# EAGLE design wheather_board_definitivo - ESP32 (EAGLE 9.6.2)
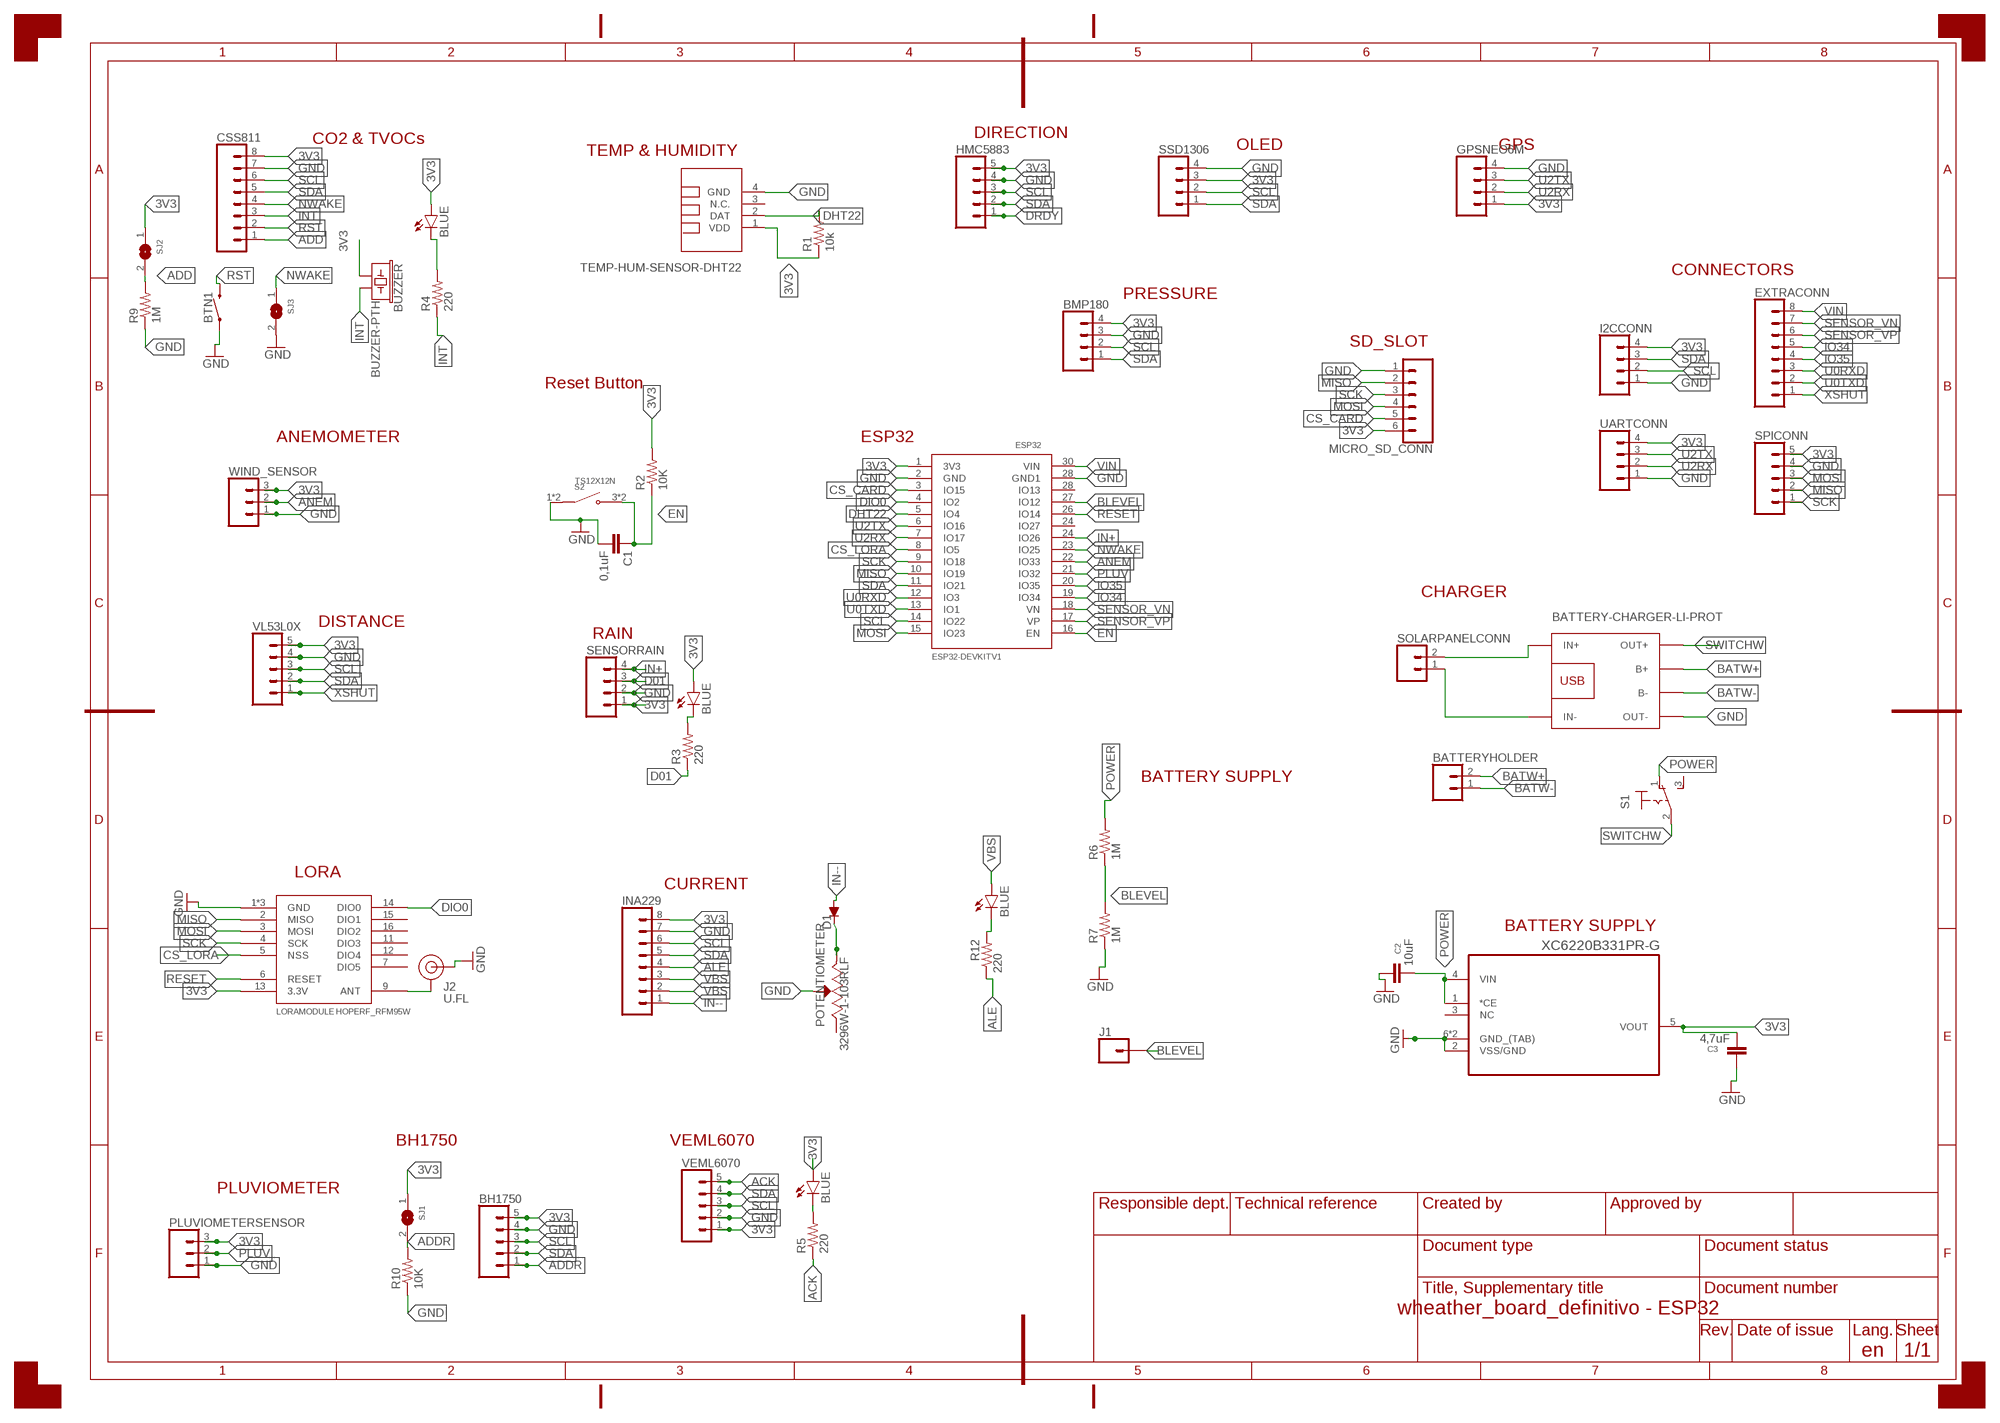
[diagram p0: schematic, sheet 1]
FRAME1 (A3_L_DOCFIELD_EN): LANGUAGE: en

## Parts
BATTERYCONN  BATTERY-CHARGER-LI-PROT  [BATTERY-CHARGER-LI-PROT]
BATTERYHOLDER  CONN_02LOCK  [1X02_LOCK]
BH1750  CONN_05  [1X05]
BMP180  CONN_04  [1X04]
BTN1  EN  MOMENTARY-SWITCH-SPST-SMD-6.0X3.5MM  [TACTILE_SWITCH_SMD_6.0X3.5MM]
BUZZER  BUZZER-PTH  [BUZZER-12MM]
C1  0,1uF  C-EUC0603  [C0603]
C2  10uF  C-EUC0603  [C0603]
C3  4,7uF  C-EUC0603  [C0603]
CSS811  CONN_08"  [1X08]
D1  DIODE_DIODE-SOD123  [DIODE_SOD123]
DHT22  TEMP-HUM-SENSOR-DHT22  [TEMP-HUM-SENSOR-DHT22]
ESP32  ESP32DEVKITV1  [ESP32-DEVKITV1]
EXTRACONN  CONN_08"  [1X08]
GPSNEO6M  CONN_04  [1X04]
HMC5883  CONN_05JST-VERT  [JST-5-PTH-VERT]
I2CCONN  CONN_04  [1X04]
INA229  CONN_08"  [1X08]
J1  CONN_01  [1X01]
J2  U.FL  U.FL2PIN  [U.FL]
LED1  BLUE  LED-BLUE0603  [LED-0603]
LED2  BLUE  LED-BLUE0603  [LED-0603]
LED3  BLUE  LED-BLUE0603  [LED-0603]
LED4  BLUE  LED-BLUE0603  [LED-0603]
LORAMODULE  HOPERF_RFM95W  [HOPERF_RFM95W]
MICRO_SD_CONN  CONN_06LOCK  [1X06_LOCK]
PLUVIOMETERSENSOR  CONN_03JST-PTH-VERT  [JST-3-PTH-VERT]
POTENTIOMETER  3296W-1-103RLF  [TRIM_3296W-1-103RLF]
R1  10k  R-US_R0603  [R0603]
R2  10K  R-US_R0603  [R0603]
R3  220  R-US_R0603  [R0603]
R4  220  R-US_R0603  [R0603]
R5  220  R-US_R0603  [R0603]
R6  1M  R-US_R0603  [R0603]
R7  1M  R-US_R0603  [R0603]
R9  1M  R-US_R0603  [R0603]
R10  10K  R-US_R0603  [R0603]
R12  220  R-US_R0603  [R0603]
S1  320-916  [320-916]
S2  TS12X12N  [SW_TS12X12N]
SENSORRAIN  CONN_04  [1X04]
SJ1  SOLDERJUMPER  [SOLDERJUMPER_ARROW_NOPASTE]
SJ2  SOLDERJUMPER  [SOLDERJUMPER_ARROW_NOPASTE]
SJ3  SOLDERJUMPER  [SOLDERJUMPER_ARROW_NOPASTE]
SOLARPANELCONN  CONN_02LOCK  [1X02_LOCK]
SPICONN  CONN_05  [1X05]
SSD1306  CONN_04  [1X04]
UARTCONN  CONN_04  [1X04]
VEML6070  CONN_05  [1X05]
VL53L0X  CONN_05JST-VERT  [JST-5-PTH-VERT]
WIND_SENSOR  CONN_03JST-PTH-VERT  [JST-3-PTH-VERT]
XC6220B331PR-G  XC6210B332PR  [XC6210B332PR]

## Nets
3V3: BH1750.5 BMP180.4 BUZZER.+ C3.2 CSS811.8 DHT22.1(VDD) ESP32.1(3V3) GPSNEO6M.1 HMC5883.5 I2CCONN.4 INA229.8 LED1.A LED2.A LED3.A LORAMODULE.13(3.3V) MICRO_SD_CONN.6 PLUVIOMETERSENSOR.3 R1.1 R2.2 SENSORRAIN.1 SJ1.1 SJ2.1 SPICONN.5 SSD1306.3 UARTCONN.4 VEML6070.1 VL53L0X.5 WIND_SENSOR.3 XC6220B331PR-G.5(VOUT)
ACK: R5.1 VEML6070.5
ADD: CSS811.1 R9.2 SJ2.2
ADDR: BH1750.1 R10.2 SJ1.2
ALE: INA229.4 R12.1
ANEM: ESP32.22(IO33) WIND_SENSOR.2
BATW+: BATTERYCONN.B+ BATTERYHOLDER.2
BATW-: BATTERYCONN.B- BATTERYHOLDER.1
BLEVEL: ESP32.27(IO12) J1.1 R6.1 R7.2
CS_CARD: ESP32.3(IO15) MICRO_SD_CONN.5
CS_LORA: ESP32.8(IO5) LORAMODULE.5(NSS)
D01: R3.1 SENSORRAIN.3
DHT22: DHT22.2(DAT) ESP32.5(IO4) R1.2
DIO0: ESP32.4(IO2) LORAMODULE.14(DIO0)
DRDY: HMC5883.1
EN: C1.1 ESP32.16(EN) R2.1 S2.3(3_4) S2.4(3_4)
GND: BATTERYCONN.OUT- BH1750.4 BMP180.3 BTN1.1 C1.2 C2.1 C3.1 CSS811.7 DHT22.4(GND) ESP32.2(GND) ESP32.28(GND1) GPSNEO6M.4 HMC5883.4 I2CCONN.1 INA229.7 J2.FEED(SIGNAL) LORAMODULE.1(GND) LORAMODULE.8(GND) LORAMODULE.10(GND) MICRO_SD_CONN.1 PLUVIOMETERSENSOR.1 POTENTIOMETER.2(WIPER) R7.1 R9.1 R10.1 S2.1(1_2) S2.2(1_2) SENSORRAIN.2 SJ3.2 SPICONN.4 SSD1306.4 UARTCONN.1 VEML6070.2 VL53L0X.4 WIND_SENSOR.1 XC6220B331PR-G.2(VSS/GND) XC6220B331PR-G.6(GND_(TAB)) XC6220B331PR-G.TAB(GND_(TAB))
IN+: ESP32.24(IO26) SENSORRAIN.4
IN++: D1.C POTENTIOMETER.3(CW)
IN--: D1.A INA229.1
INT: BUZZER.- CSS811.3 R4.1
IO34: ESP32.19(IO34) EXTRACONN.5
IO35: ESP32.20(IO35) EXTRACONN.4
MISO: ESP32.10(IO19) LORAMODULE.2(MISO) MICRO_SD_CONN.2 SPICONN.2
MOSI: ESP32.15(IO23) LORAMODULE.3(MOSI) MICRO_SD_CONN.4 SPICONN.3
N$1: LED2.C R4.2
N$2: LED1.C R3.2
N$3: BATTERYCONN.IN- SOLARPANELCONN.1
N$4: BATTERYCONN.IN+ SOLARPANELCONN.2
N$5: LED3.C R5.2
N$7: LED4.C R12.2
N$12: J2.1(GND) J2.2(GND) LORAMODULE.9(ANT)
NWAKE: CSS811.4 ESP32.23(IO25) SJ3.1
PLUV: ESP32.21(IO32) PLUVIOMETERSENSOR.2
POWER: C2.2 R6.2 S1.1(O) XC6220B331PR-G.1(*CE) XC6220B331PR-G.4(VIN)
RESET: ESP32.26(IO14) LORAMODULE.6(RESET)
RST: BTN1.2 CSS811.2
SCK: ESP32.9(IO18) LORAMODULE.4(SCK) MICRO_SD_CONN.3 SPICONN.1
SCL: BH1750.3 BMP180.2 CSS811.6 ESP32.14(IO22) HMC5883.3 I2CCONN.2 INA229.6 SSD1306.2 VEML6070.3 VL53L0X.3
SDA: BH1750.2 BMP180.1 CSS811.5 ESP32.11(IO21) HMC5883.2 I2CCONN.3 INA229.5 SSD1306.1 VEML6070.4 VL53L0X.2
SENSOR_VN: ESP32.18(VN) EXTRACONN.7
SENSOR_VP: ESP32.17(VP) EXTRACONN.6
SWITCHW: BATTERYCONN.OUT+ S1.2(P)
U0RXD: ESP32.12(IO3) EXTRACONN.3
U0TXD: ESP32.13(IO1) EXTRACONN.2
U2RX: ESP32.7(IO17) GPSNEO6M.2 UARTCONN.2
U2TX: ESP32.6(IO16) GPSNEO6M.3 UARTCONN.3
VBS: INA229.2 INA229.3 LED4.A
VIN: ESP32.30(VIN) EXTRACONN.8
XSHUT: EXTRACONN.1 VL53L0X.1
Unconnected: DHT22.3(N.C.) ESP32.24(IO27) ESP32.28(IO13) LORAMODULE.7(DIO5) LORAMODULE.11(DIO3) LORAMODULE.12(DIO4) LORAMODULE.15(DIO1) LORAMODULE.16(DIO2) POTENTIOMETER.1(CCW) S1.3(S) XC6220B331PR-G.3(NC)

## Notes on the sheet
- DIRECTION
- CO2 & TVOCs
- OLED | GPS
- TEMP & HUMIDITY
- CONNECTORS
- PRESSURE
- SD_SLOT
- Reset Button
- ANEMOMETER | ESP32
- CHARGER
- DISTANCE
- RAIN
- BATTERY SUPPLY
- LORA
- CURRENT
- BATTERY SUPPLY
- BH1750 | VEML6070
- PLUVIOMETER

## Library data of the parts
BATTERYCONN = diy-modules:BATTERY-CHARGER-LI-PROT: Lithium Battery 5V Charger with protection circuit More details available here: http://www.instructables.com/id/DIY-Lithium-ion-Battery-Charger/step4/TP4056-based-lithium-ion-battery-charger-module/ Click here to find device on ebay.com
BATTERYHOLDER SOLARPANELCONN = SparkFun-Connectors:CONN_02: Multi connection point. Often used as Generic Header-pin footprint for 0.1 inch spaced/style header connections On any of the 0.1 inch spaced packages, you can populate with these: Break Away Headers - Straight (PRT-00116) Break Away Male Headers - Right Angle (PRT-00553) Female Headers (PRT-00115) Break Away Headers - Machine Pin (PRT-00117) Break Away Female Headers - Swiss Machine Pin (PRT-00743) For SCREWTERMINALS and SPRING TERMINALS visit here: Screw Terimnals on SparkFun.com (5mm/3.5mm/2.54mm spacing) This device is also useful as a general connection point to wire up your design to another part of your project. Our various solder wires solder well into these plated through hole pads. Hook-Up Wire - Assortment (Stranded, 22 AWG) (PRT-11375) Hook-Up Wire - Assortment (Solid Core, 22 AWG) (PRT-11367) View the entire wire category on our website here Special notes: Molex polarized connector foot print use with: PRT-08233 with associated crimp pins and housings. 2.54_SCREWTERM for use with PRT-10571. 3.5mm Screw Terminal footprints for PRT-08084 5mm Screw Terminal footprints for use with PRT-08432
BH1750 HMC5883 SPICONN VEML6070 VL53L0X = SparkFun-Connectors:CONN_05: Multi connection point. Often used as Generic Header-pin footprint for 0.1 inch spaced/style header connections On any of the 0.1 inch spaced packages, you can populate with these: Break Away Headers - Straight (PRT-00116) Break Away Male Headers - Right Angle (PRT-00553) Female Headers (PRT-00115) Break Away Headers - Machine Pin (PRT-00117) Break Away Female Headers - Swiss Machine Pin (PRT-00743) For SCREWTERMINALS and SPRING TERMINALS visit here: Screw Terimnals on SparkFun.com (5mm/3.5mm/2.54mm spacing) This device is also useful as a general connection point to wire up your design to another part of your project. Our various solder wires solder well into these plated through hole pads. Hook-Up Wire - Assortment (Stranded, 22 AWG) (PRT-11375) Hook-Up Wire - Assortment (Solid Core, 22 AWG) (PRT-11367) View the entire wire category on our website here Special notes: Molex polarized connector foot print use with SKU : PRT-08231 with associated crimp pins and housings. 1MM SMD Version SKU: PRT-10208
BMP180 GPSNEO6M I2CCONN SENSORRAIN SSD1306 UARTCONN = SparkFun-Connectors:CONN_04: Multi connection point. Often used as Generic Header-pin footprint for 0.1 inch spaced/style header connections On any of the 0.1 inch spaced packages, you can populate with these: Break Away Headers - Straight (PRT-00116) Break Away Male Headers - Right Angle (PRT-00553) Female Headers (PRT-00115) Break Away Headers - Machine Pin (PRT-00117) Break Away Female Headers - Swiss Machine Pin (PRT-00743) For SCREWTERMINALS and SPRING TERMINALS visit here: Screw Terimnals on SparkFun.com (5mm/3.5mm/2.54mm spacing) This device is also useful as a general connection point to wire up your design to another part of your project. Our various solder wires solder well into these plated through hole pads. Hook-Up Wire - Assortment (Stranded, 22 AWG) (PRT-11375) Hook-Up Wire - Assortment (Solid Core, 22 AWG) (PRT-11367) View the entire wire category on our website here Special notes: Molex polarized connector foot print use with SKU : PRT-08231 with associated crimp pins and housings. 1MM SMD Version SKU: PRT-10208; PROD_ID: CONN-09696
BTN1 = SparkFun-Switches:MOMENTARY-SWITCH-SPST: Momentary Switch (Pushbutton) - SPST Normally-open (NO) SPST momentary switches (buttons, pushbuttons). Variants PTH-12MM - 12mm square, through-hole Momentary Pushbutton Switch - 12mm Square (COM-09190) PTH-6.0MM, PTH-6.0MM-KIT - 6.0mm square, through-hole Mini Pushbutton Switch (COM-00097) KIT package intended for soldering kit's - only one side of pads' copper is exposed. PTH-RIGHT-ANGLE-KIT - Right-angle, through-hole Right Angle Tactile Button - Used on SparkFun BigTime Watch Kit SMD-12MM - 12mm square, surface-mount Tactile Button - SMD (12mm) (COM-12993) Used on SparkFun PicoBoard SMD-4.5MM - 4.5mm Square Trackball Switch Used on SparkFun Blackberry Trackballer Breakout SMD-4.6MMX2.8MM - 4.60mm x 2.80mm, surface mount Used on SparkFun SAMD21 Mini Breakout SMD-5.2MM, SMD-5.2-REDUNDANT - 5.2mm square, surface-mount Mini Pushbutton Switch - SMD (COM-08720) Used on Arduino Pro Mini REDUNDANT package connects both switch circuits together SMD-6.0X3.5MM - 6.0 x 3.5mm, surface mount Momentary Reset Switch SMD (COM-08229) SMD-6.2MM-TALL - 6.2mm square, surface mount Tactile Button - SMD (6mm) Used on SparkFun Digital Sandbox SMD-RIGHT-ANGLE - Right-angle, surface mount Used on SparkFun Block for Intel® Edison - Arduino; PROD_ID: SWCH-00815; SF_SKU: COM-08229
BUZZER = SparkFun-Electromechanical:BUZZER: Buzzer Small round buzzers that operate around the audible 2kHz range. You can use these as speakers to create simple music or user interfaces. Variant Overview: PTH - Mini Speaker - PC Mount 12mm 2.048kHz PTH_KIT - Mini Speaker - PC Mount 12mm 2.048kHz KIT simplifies soldering by adding stop mask to one side of the pads. PTH_NO_SILK - Mini Speaker - PC Mount 12mm 2.048kHz No silkscreen indicator of buzzer outline. PTH_KIT_NO_SILK - Mini Speaker - PC Mount 12mm 2.048kHz KIT package w/o silkscreen SMD - Buzzer Audio Magnetic (CCV-084B16) SMD buzzer used on, e.g. the LilyPad Buzzer and RFID USB Reader. SMD_KIT - Buzzer Audio Magnetic (CCV-084B16) SMD Buzzer with elongated pins to make soldering easier. Used on the SparkFun Simon Says - Surface Mount Soldering Kit.; PROD_ID: COMP-08253; SF_SKU: COM-07950
C1-C3 = rcl:C-EU: CAPACITOR, European symbol; SPICEPREFIX: C
CSS811 EXTRACONN INA229 = SparkFun-Connectors:CONN_08: Multi connection point. Often used as Generic Header-pin footprint for 0.1 inch spaced/style header connections On any of the 0.1 inch spaced packages, you can populate with these: Break Away Headers - Straight (PRT-00116) Break Away Male Headers - Right Angle (PRT-00553) Female Headers (PRT-00115) Break Away Headers - Machine Pin (PRT-00117) Break Away Female Headers - Swiss Machine Pin (PRT-00743) Arduino Stackable Header - 8 Pin (PRT-09279) For SCREWTERMINALS and SPRING TERMINALS visit here: Screw Terimnals on SparkFun.com (5mm/3.5mm/2.54mm spacing) This device is also useful as a general connection point to wire up your design to another part of your project. Our various solder wires solder well into these plated through hole pads. Hook-Up Wire - Assortment (Stranded, 22 AWG) (PRT-11375) Hook-Up Wire - Assortment (Solid Core, 22 AWG) (PRT-11367) View the entire wire category on our website here Special notes: Molex polarized connector foot print use with SKU : PRT-08231 with associated crimp pins and housings. 1MM SMD Version SKU: PRT-10208 NOTES ON THE VARIANTS LOCK and LOCK_LONGPADS... This footprint was designed to help hold the alignment of a through-hole component (i.e. 6-pin header) while soldering it into place. You may notice that each hole has been shifted either up or down by 0.005 of an inch from it's more standard position (which is a perfectly straight line). This slight alteration caused the pins (the squares in the middle) to touch the edges of the holes. Because they are alternating, it causes a "brace" to hold the component in place. 0.005 has proven to be the perfect amount of "off-center" position when using our standard breakaway headers. Although looks a little odd when you look at the bare footprint, once you have a header in there, the alteration is very hard to notice. Also,if you push a header all the way into place, it is covered up entirely on the bottom side.; PROD_ID: CONN-08438
D1 = 52101-101-REV-A:DIODE_DIODE-: DIODE
DHT22 = diy-modules:TEMP-HUM-SENSOR-DHT22: DHT22 - digital humidity & temperature sensor Also known as: AM2302 AM2302 datasheet available here: http://akizukidenshi.com/download/ds/aosong/AM2302.pdf Click here to find device on ebay.com
ESP32 = ESP32-DEVKITV1:ESP32DEVKITV1
J1 = SparkFun-Connectors:CONN_01: Single connection point. Often used as Generic Header-pin footprint for 0.1 inch spaced/style header connections On any of the 0.1 inch spaced packages, you can populate with these: Break Away Headers - Straight (PRT-00116) Break Away Male Headers - Right Angle (PRT-00553) Female Headers (PRT-00115) Break Away Headers - Machine Pin (PRT-00117) Break Away Female Headers - Swiss Machine Pin (PRT-00743) This device is also useful as a general connection point to wire up your design to another part of your project. Our various solder wires solder well into these plated through hole pads. Hook-Up Wire - Assortment (Stranded, 22 AWG) (PRT-11375) Hook-Up Wire - Assortment (Solid Core, 22 AWG) (PRT-11367) View the entire wire category on our website here Special notes: SMTSO-256-ET is a "flush mount" nut for a 4-40 screw. We mostly use this on specialty testbeds; it is a nice way to connect hardware to your PCB at an adjustable hieght. Also note, the SNAP packages are for using a snappable style connector. We sell a baggie of snaps and they are also used on two LilyPad designs: Snap Assortment - 30 pack (male and female) (DEV-11347) LilyPad Arduino SimpleSnap (DEV-10941) LilyPad SimpleSnap Protoboard (DEV-10940)
J2 = SparkFun-Connectors:U.FL2PIN: SMD Antenna Connector - U.FL 2mm height, 3.0mm x 3.0mm receptacle size. SparkFun Products: SparkFun WiFi Shield - ESP8266 <https://www.sparkfun.com/products/13287> SparkFun ESP8266 Thing <https://www.sparkfun.com/products/13231> SparkFun MiniGen - Pro Mini Signal Generator Shield <https://www.sparkfun.com/products/11420>; PROD_ID: CONN-09193; SF_ID: WRL-09144
LED1-LED4 = SparkFun-LED:LED-BLUE: Blue SMD LED Used in manufacturing of various products at SparkFun Packages: 0603 - SMD 0603 package [Product Link] <http://www.digikey.com/product-detail/en/SMLE12BC7TT86/511-1589-2-ND/1641808> 1206 - SMD1206 package [Product Link] <http://www.digikey.com/product-detail/en/lite-on-inc/LTST-C150TBKT/160-1643-1-ND/573584> SparkFun Products: ESP8266 Thing-Dev Board <https://www.sparkfun.com/products/13711> RedBoard <https://www.sparkfun.com/products/12757>; PROD_ID: DIO-08575
LORAMODULE = lora-lorawan-modules:HOPERF_RFM95W: HopeRF LoRaWAN modules Link: http://www.hoperf.com/rf_transceiver/lora/; HEIGHT: 1.8; LENGTH: 16; WIDTH: 16
MICRO_SD_CONN = SparkFun-Connectors:CONN_06: Multi connection point. Often used as Generic Header-pin footprint for 0.1 inch spaced/style header connections On any of the 0.1 inch spaced packages, you can populate with these: Break Away Headers - Straight (PRT-00116) Break Away Male Headers - Right Angle (PRT-00553) Female Headers (PRT-00115) Break Away Headers - Machine Pin (PRT-00117) Break Away Female Headers - Swiss Machine Pin (PRT-00743) Arduino Stackable Header - 6 Pin (PRT-09280) For SCREWTERMINALS and SPRING TERMINALS visit here: Screw Terimnals on SparkFun.com (5mm/3.5mm/2.54mm spacing) This device is also useful as a general connection point to wire up your design to another part of your project. Our various solder wires solder well into these plated through hole pads. Hook-Up Wire - Assortment (Stranded, 22 AWG) (PRT-11375) Hook-Up Wire - Assortment (Solid Core, 22 AWG) (PRT-11367) View the entire wire category on our website here
PLUVIOMETERSENSOR WIND_SENSOR = SparkFun-Connectors:CONN_03: Multi connection point. Often used as Generic Header-pin footprint for 0.1 inch spaced/style header connections On any of the 0.1 inch spaced packages, you can populate with these: Break Away Headers - Straight (PRT-00116) Break Away Male Headers - Right Angle (PRT-00553) Female Headers (PRT-00115) Break Away Headers - Machine Pin (PRT-00117) Break Away Female Headers - Swiss Machine Pin (PRT-00743) Stackable Header - 3 Pin (Female, 0.1") (PRT-13875) For SCREWTERMINALS and SPRING TERMINALS visit here: Screw Terimnals on SparkFun.com (5mm/3.5mm/2.54mm spacing) This device is also useful as a general connection point to wire up your design to another part of your project. Our various solder wires solder well into these plated through hole pads. Hook-Up Wire - Assortment (Stranded, 22 AWG) (PRT-11375) Hook-Up Wire - Assortment (Solid Core, 22 AWG) (PRT-11367) View the entire wire category on our website here Special notes: Molex polarized connector foot print use with SKU : PRT-08232 with associated crimp pins and housings.; PROD_ID: CONN-13230
POTENTIOMETER = 3296W-1-103RLF:3296W-1-103RLF: Res Cermet Trimmer 500K Ohm 10% 0.5W 25(Elec)Turn 2.19mm (9.53 X 4.83 X 11.55mm) Pin Thru-Hole Tube Check availability; AVAILABILITY: In Stock; DESCRIPTION: 10 kOhms 0.5W, 1/2W PC Pins Through Hole Trimmer Potentiometer Cermet 25.0 Turn Top Adjustment; MF: Bourns; MP: 3296W-1-103RLF; PACKAGE: SOT-23-5 Bourns; PRICE: None; PURCHASE-URL: https://pricing.snapeda.com/search/part/3296W-1-103RLF/?ref=eda
R1-R7 R9 R10 R12 = rcl:R-US_: RESISTOR, American symbol; SPICEPREFIX: R
S1 = switch:320-916: TOGGLE SWITCH distributor RS Components
S2 = TS12X12N:TS12X12N: 12x12 - Tact switch. Check availability; AVAILABILITY: Not in stock; DESCRIPTION: 12x12 - Tact switch; MF: Aitendo; MP: TS12X12N; PACKAGE: Package; PRICE: None
SJ1-SJ3 = microbuilder:SOLDERJUMPER: SMD Solder JUMPER Solder the two pads together to create a connection, or remove the solder to break it. REFLOW - Use this footprint for solder paste and reflow ovens. WAVE - Use this footprint for hand-soldering (larger pads). CLOSED - Has a trace between the two pads to ensure it is closed by default. The trace needs to be cut to disable the jumper, and can be closed again by creating a solder bridge between the two pads.; BOM: EXCLUDE
XC6220B331PR-G = XC6210B332PR:XC6210B332PR: IC, LDO VOLT REG, 3V, 1A; AVAILABILITY: Good; DESCRIPTION: Ic, Linear Regulator; Max. Input, 6v; Output, 3v; 1000ma; Accuracy, 0.5%; Sot223-5; MF: Microchip; MP: MCP1826T-3002E/DC; PACKAGE: SOT-223 Microchip; PRICE: 0.59 USD

## Net classes
1 GND: width 0.4 mm

## Board
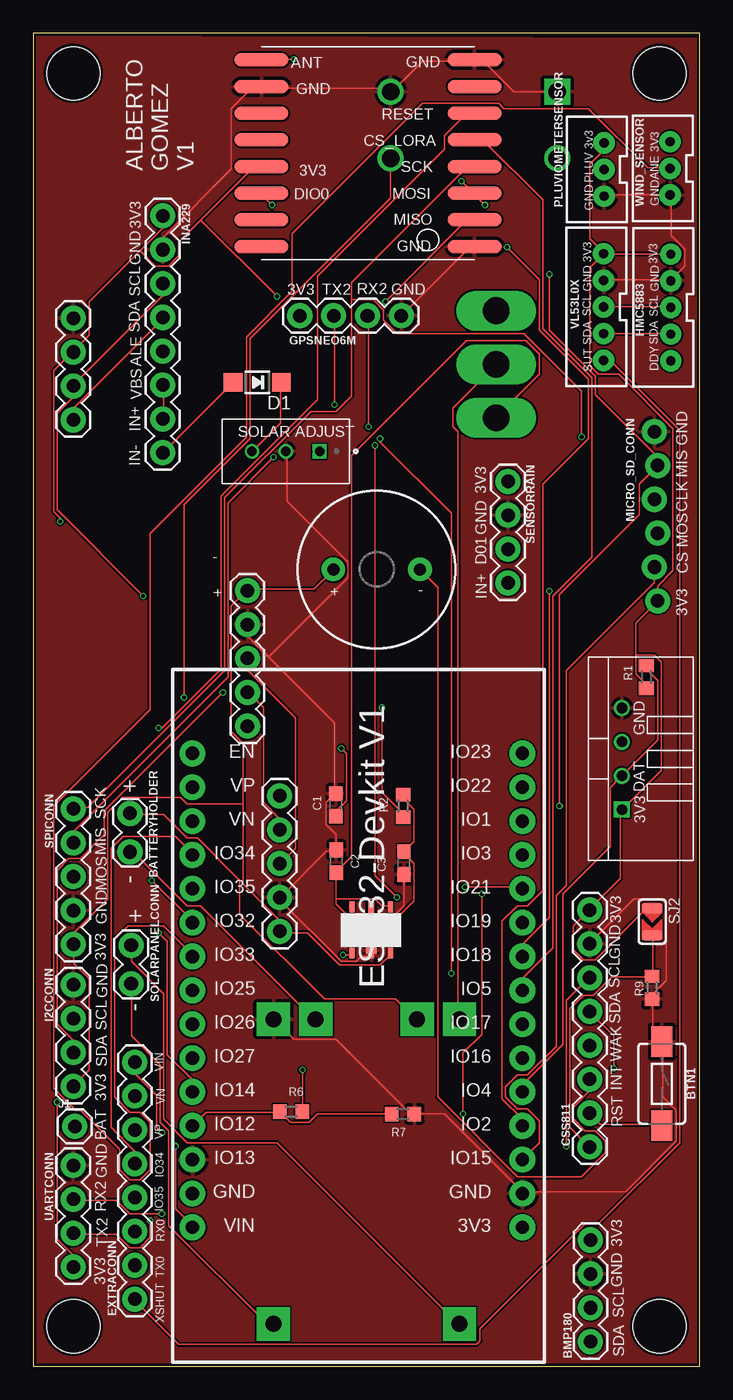
[diagram p1: board, top side]
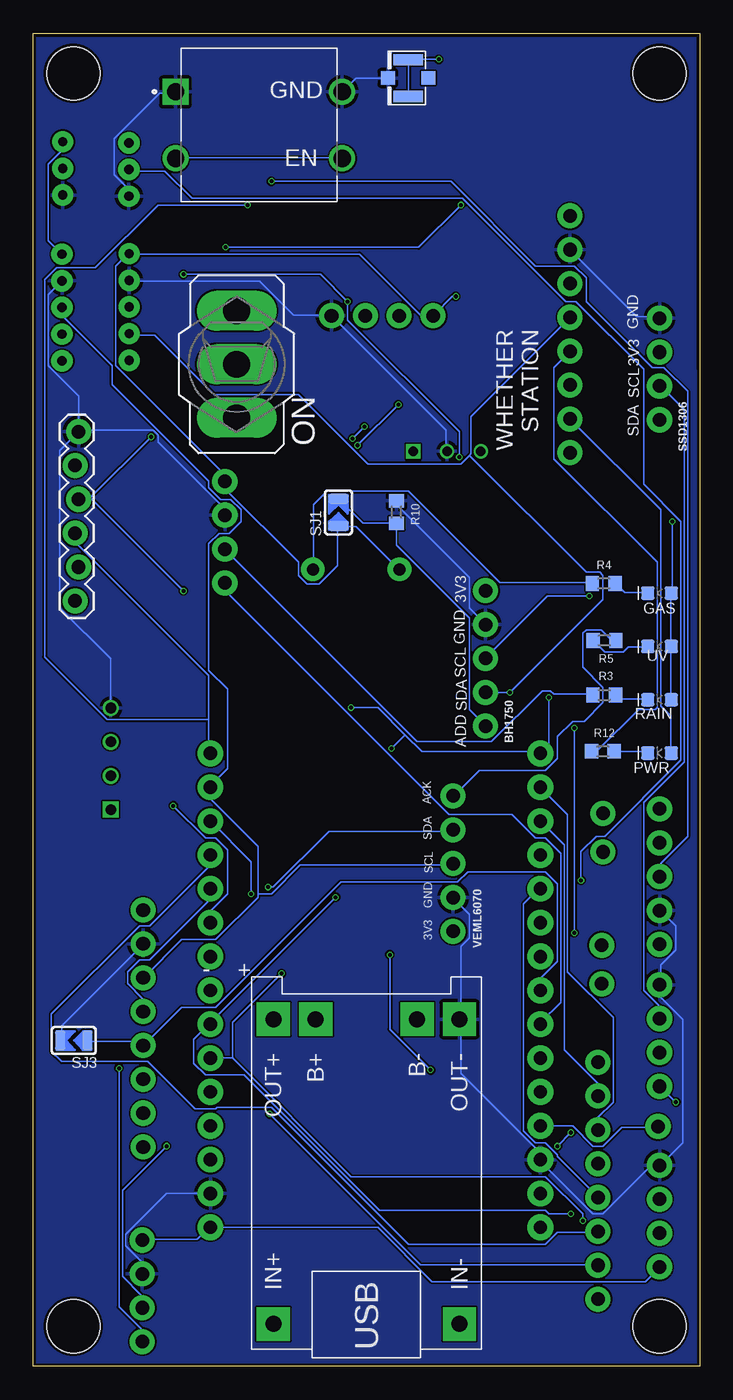
[diagram p2: board, bottom side, seen from below]

Size 50 x 100 mm. Coordinates in mm from the lower left corner, seen from the top.
Outline: 0,100 0,0 50,0 50,100 0,100
Copper layers (1*16): Top 0.035559375mm / dielectric 1.6mm / Bottom 0.035559375mm
Design rules "jlcpcb2layer": minimum track width 5mil, minimum drill 12mil, track to track 5mil, track to pad 5mil, pad to pad 5mil, via to via 5mil, smd to smd 5mil, copper to edge 8mil, drill to drill 6mil, minimum pad ring 5mil, minimum via ring 3mil, stop-mask expansion 2.5mil, vias tented up to drill 0mil, thermal gap 10mil
Holes 4 mm at 3,97 47,97 3,3 47,3

### Footprints (pad centres in the part's own frame; a part is rotated, then mirrored left to right if it is on the bottom)
BATTERY-CHARGER-LI-PROT = drill 1.2 pad 2.5 square: B+ 10.795,3.81; B- 10.795,-3.81; IN+ -12.065,6.985; IN- -12.065,-6.985; OUT+ 10.795,6.985; OUT- 10.795,-6.985
1X02_LOCK = drill 1.016 pad 1.88: 1 -0.178,0; 2 2.718,0
1X05 = drill 1.016 pad 1.88: 1 0,0; 2 2.54,0; 3 5.08,0; 4 7.62,0; 5 10.16,0
1X04 = drill 1.016 pad 1.88: 1 0,0; 2 2.54,0; 3 5.08,0; 4 7.62,0
TACTILE_SWITCH_SMD_6.0X3.5MM = smd 2.3 x 1.6: 1 -3.15,0; 2 3.15,0
BUZZER-12MM = drill 0.9 pad 1.778: + 3.25,0; - -3.25,0
C0603 = smd 1.1 x 1: 1 -0.85,0; 2 0.85,0
1X08 = drill 1.016 pad 1.88: 1 0,0; 2 2.54,0; 3 5.08,0; 4 7.62,0; 5 10.16,0; 6 12.7,0; 7 15.24,0; 8 17.78,0
DIODE_SOD123 = smd 1.4 x 1.4: A 1.805,0; C -1.805,0
TEMP-HUM-SENSOR-DHT22 = drill 0.8 square: 1 -3.81,0 | drill 0.8: 2 -1.27,0; 3 1.27,0; 4 3.81,0
ESP32-DEVKITV1 = drill 1 pad 1.93: 1 -22.87,-13.54; 2 -20.33,-13.54; 3 -17.79,-13.54; 4 -15.25,-13.54; 5 -12.71,-13.54; 6 -10.17,-13.54; 7 -7.63,-13.54; 8 -5.09,-13.54; 9 -2.55,-13.54; 10 -0.01,-13.54; 11 2.53,-13.54; 12 5.07,-13.54; 13 7.61,-13.54; 14 10.15,-13.54; 15 12.69,-13.54; 16 12.69,11.23; 17 10.15,11.23; 18 7.61,11.23; 19 5.07,11.23; 20 2.53,11.23; 21 -0.01,11.23; 22 -2.55,11.23; 23 -5.09,11.23; 24 -7.63,11.23; 25 -10.17,11.23; 26 -12.71,11.23; 27 -15.25,11.23; 28 -17.79,11.23; 29 -20.33,11.23; 30 -22.87,11.23
JST-5-PTH-VERT = drill 0.7 pad 1.6: 1 -4,0.18; 2 -2,0.18; 3 0,0.18; 4 2,0.18; 5 4,0.18
1X01 = drill 1.016 pad 1.88: 1 0,0
U.FL = smd 2.2 x 0.85: 1 0,1.375; 2 0,-1.375 | smd 1.05 x 1: FEED 1.525,0; NC -1.525,0
LED-0603 = smd 1 x 1: A -0.877,0; C 0.877,0
HOPERF_RFM95W = smd 4.064 x 1.016: 1 -8.12,7.13; 2 -8.12,5.13; 3 -8.12,3.13; 4 -8.12,1.13; 5 -8.12,-0.87; 6 -8.12,-2.87; 7 -8.12,-4.87; 8 -8.12,-6.87; 9 7.88,-6.87; 10 7.88,-4.87; 11 7.88,-2.87; 12 7.88,-0.87; 13 7.88,1.13; 14 7.88,3.13; 15 7.88,5.13; 16 7.88,7.13
1X06_LOCK = drill 1.016 pad 1.88: 1 0,0; 2 2.54,-0.254; 3 5.08,0; 4 7.62,-0.254; 5 10.16,0; 6 12.7,-0.254
JST-3-PTH-VERT = drill 0.7 pad 1.6: 1 -2,-0.55; 2 0,-0.55; 3 2,-0.55
TRIM_3296W-1-103RLF = drill 0.71 square: 1 -2.54,0 | drill 0.71: 2 0,0; 3 2.54,0
R0603 = smd 1 x 1.1: 1 -0.85,0; 2 0.85,0
320-916 = drill 2.007 long: 1 0,4.013; 2 0,0; 3 0,-4.013
SW_TS12X12N = drill 1.3 square: 1 -6.25,2.5 | drill 1.3: 2 6.25,2.5; 3 -6.25,-2.5; 4 6.25,-2.5
SOLDERJUMPER_ARROW_NOPASTE = smd 0.762 x 1.524: 1 -1.016,0; 2 1.016,0
XC6210B332PR = smd 0.4 x 0.8: 1 -3.88,0.94; 3 -1,0.94; 4 -1,4.42; 5 -3.88,4.42 | smd 0.4 x 4: 2 -2.44,2.54 | smd 0.762 x 0.508: 6 -2.44,4.213 | smd 0.42 x 0.4: TAB -2.44,4.613

### Placement (x,y rotation side)
BATTERYCONN  25,15.24 90 bottom
BATTERYHOLDER  7.25,38.76 90 top
BH1750  16.07,48.02 90 top
BMP180  41.82,1.84 90 top
BTN1  47.17,21.2 270 top
BUZZER  25.77,59.78 180 top
C1  22.71,42.1 90 top
C2  22.73,37.88 270 top
C3  27.81,37.74 90 top
CSS811  41.76,16.45 90 top
D1  16.8,73.81 180 top
DHT22  44.18,45.57 90 top
ESP32  23.17,33.29 90 top
EXTRACONN  7.62,5.03 90 top
GPSNEO6M  20,78.82 0 top
HMC5883  48.02,79.43 90 top
I2CCONN  3,28.61 270 top
INA229  9.72,68.53 90 top
J1  3.11,17.98 0 top
J2  21.87,96.65 180 bottom
LED1  3,50 180 bottom
LED2  3,58 180 bottom
LED3  3,54 180 bottom
LED4  3,46 180 bottom
LORAMODULE  25,91.14 180 top
MICRO_SD_CONN  46.61,70.12 270 bottom
PLUVIOMETERSENSOR  42.28,89.78 90 top
POTENTIOMETER  18.95,68.64 180 top
R1  46.01,51.71 90 top
R2  27.76,42.04 90 top
R3  7.15,50.36 0 bottom
R4  7.19,58.72 0 bottom
R5  7.14,54.44 180 bottom
R6  19.34,19.1 0 top
R7  27.75,18.92 180 top
R9  46.43,28.4 90 top
R10  22.75,64.08 270 bottom
R12  7.25,46.13 0 bottom
S1  34.73,75.17 180 bottom
S2  33.07,93.12 0 bottom
SENSORRAIN  35.62,66.38 270 top
SJ1  27.1,64.06 90 bottom
SJ2  46.44,33.35 270 top
SJ3  46.96,24.43 180 bottom
SOLARPANELCONN  7.34,28.87 90 top
SPICONN  3,41.81 270 top
SSD1306  3,71 90 top
UARTCONN  3,15.06 270 top
VEML6070  18.49,32.63 90 top
VL53L0X  42.99,79.46 90 top
WIND_SENSOR  47.24,89.87 90 top
XC6220B331PR-G  22.92,35.39 180 top

### Tracks (layer width: path | path; a pad name or v marks a point on that pad's centre or on a via)
3V3  (via drill 0.3)
  Top 0.127: v1.78,19.81 1.78,9.53 2.92,8.38 2.92,7.49 UARTCONN.4 | I2CCONN.4 3.05,21.08 4.19,22.23 4.19,29.08 3.05,30.23 3.05,31.62 SPICONN.5 3.05,31.75 3.05,32.51 5.59,35.05 5.59,41.53 6.73,42.67 11.05,42.67 11.56,42.16 15.75,42.16 | R2.2 27.81,42.8 27.81,42.55 28.57,41.78 28.57,39.37 27.81,38.61 C3.2 27.81,38.48 28.57,37.72 28.57,34.92 26.92,33.27 26.92,30.99 XC6220B331PR-G.5 26.8,30.86 26.04,30.1 22.99,30.1 20.57,32.51 18.54,32.51 VEML6070.1 18.41,32.64 18.41,33.53 15.75,36.2 15.75,42.16 | BUZZER.+ 22.48,59.69 21.08,58.29 16.13,58.29 BH1750.5 16,58.17 14.86,57.02 14.86,47.62 15.75,46.74 15.75,42.16 | v2.03,63.37 2.03,63.63 1.52,64.14 1.52,74.68 2.92,76.07 SSD1306.3 3.05,76.2 4.19,77.34 4.19,79.88 8,83.69 | 8,83.69 9.65,85.34 9.65,86.23 INA229.8 | 12.57,85.98 10.92,84.33 10.92,83.31 10.16,82.55 9.14,82.55 8,83.69 | 12.57,85.98 16.51,89.92 17.02,89.92 LORAMODULE.13 | 45.21,53.34 45.21,55.75 46.86,57.4 MICRO_SD_CONN.6 46.86,58.55 48.01,59.69 48.01,70.36 43.94,74.42 42.42,74.42 41.78,75.06 41.78,82.42 42.8,83.44 VL53L0X.5 | 45.21,53.34 45.21,51.94 45.97,51.18 45.97,50.93 R1.1 | SJ2.1 46.35,34.29 45.97,34.29 42.16,30.48 41.27,30.48 40.51,31.24 40.51,33.02 41.66,34.16 CSS811.8 41.78,34.29 44.07,36.58 44.07,41.66 DHT22.1 44.2,41.78 47.12,44.7 47.12,52.83 46.61,53.34 45.21,53.34 | VL53L0X.5 42.93,83.44 47.75,83.44 HMC5883.5 | PLUVIOMETERSENSOR.3 42.8,91.69 42.8,91.19 41.78,90.17 41.78,84.58 42.8,83.57 VL53L0X.5 | v18.29,80.26 12.57,85.98
  Bottom 0.127: BMP180.4 41.78,9.53 37.72,9.53 36.83,10.41 ESP32.1 24.13,10.41 20.07,6.35 4.06,6.35 3.05,7.37 UARTCONN.4 | v1.78,19.81 2.92,20.95 I2CCONN.4 | BUZZER.+ 22.61,59.82 25.78,62.99 27.05,62.99 SJ1.1 27.18,62.99 27.18,60.07 28.57,58.67 29.46,58.67 30.1,59.31 30.1,60.33 35.56,65.79 35.56,66.29 SENSORRAIN.1 35.69,66.42 35.69,66.93 43.81,75.06 43.81,82.55 42.93,83.44 VL53L0X.5 42.8,83.44 25.53,83.44 20.95,78.87 20.07,78.87 GPSNEO6M.1 19.94,78.87 18.54,80.26 v18.29,80.26 | LED1.A 2.16,50.04 2.16,53.98 LED3.A 2.16,54.1 2.16,57.91 LED2.A 2.03,58.04 v2.03,63.37 | WIND_SENSOR.3 47.88,91.82 47.88,91.19 48.9,90.17 48.9,84.45 47.88,83.44 HMC5883.5
ACK
  Bottom 0.127: R5.1 6.35,54.48 6.6,54.48 7.37,55.24 8.51,55.24 8.76,54.99 8.76,52.45 7.24,50.93 7.24,49.78 8.64,48.39 9.53,48.39 10.67,47.24 10.67,45.59 11.56,44.7 16.51,44.7 18.41,42.8 VEML6070.5
ADD
  Top 0.127: SJ2.2 46.48,32.26 46.48,29.34 R9.2 46.35,29.21 43.43,29.21 42.04,27.81 41.27,27.81 40.26,26.8 40.26,17.91 41.66,16.51 CSS811.1
ADDR
  Bottom 0.127: SJ1.2 25.27,63.25 22.86,63.25 R10.2 22.73,63.12 22.73,61.59 17.27,56.13 17.27,49.28 16.13,48.13 BH1750.1
ALE
  Bottom 0.127: R12.1 8,46.23 7.62,46.23 4.57,49.28 3.3,49.28 3.17,49.4 3.17,60.33 10.92,68.07 10.92,74.93 9.78,76.07 INA229.4
ANEM
  Top 0.127: WIND_SENSOR.2 47.75,89.92 46.1,89.92 41.66,94.36 35.31,94.36 34.92,94.74 29.21,94.74 19.43,84.96 19.43,80.64 16,77.22 16,69.72 8.76,62.48 8.76,49.28 1.52,42.04 1.52,20.83 3.17,19.18 3.56,19.18 6.48,16.26 6.48,14.73 7.24,13.97 8,13.97 8.76,14.73 8.76,18.29 8,19.05 7.24,19.05 6.1,20.19 6.1,32 7.11,33.02 9.78,33.02 11.94,30.86 ESP32.22
BATW+
  Top 0.127: BATTERYHOLDER.2 7.37,41.4 9.78,41.4 11.56,39.62 12.32,39.62 15.49,36.45 15.49,33.91 21.84,27.56 27.18,27.56 28.7,26.04 BATTERYCONN.B+
BATW-
  Top 0.127: BATTERYHOLDER.1 7.37,38.48 7.62,38.48 11.56,34.54 12.57,34.54 21.08,26.04 BATTERYCONN.B-
BLEVEL
  Top 0.127: ESP32.27 12.06,18.16 12.95,19.05 18.41,19.05 R6.1 18.54,19.05 19.3,18.29 20.7,18.29 21.34,18.92 R7.2
  Bottom 0.127: J1.1 3.17,17.91 5.84,17.91 7.24,16.51 8,16.51 9.53,18.03 ESP32.27
CS_CARD
  Top 0.127: MICRO_SD_CONN.5 46.61,58.8 40.01,52.2 40.01,36.07 39.24,35.31 39.24,24 37.08,21.84 36.32,21.84 35.43,20.95 35.43,20.19 36.32,19.3 37.08,19.3 37.97,18.41 37.97,16.76 36.83,15.62 ESP32.3
CS_LORA
  Top 0.127: ESP32.8 36.83,28.32 36.83,29.21 38.99,31.37 38.99,57.78 41.91,60.71 41.91,74.17 38.23,77.85 38.23,87.5 33.78,91.95 33.15,91.95 LORAMODULE.5
D01
  Bottom 0.127: R3.1 8,50.42 10.92,50.42 11.18,50.67 11.81,50.67 15.62,46.86 21.21,46.86 35.56,61.21 SENSORRAIN.3
DHT22
  Top 0.127: R1.2 46.1,52.45 46.1,52.2 46.86,51.44 46.86,46.99 44.2,44.32 DHT22.2 44.07,44.2 43.31,43.43 43.31,38.99 39.75,35.43 39.75,24.13 36.83,21.21 36.83,20.7 ESP32.5
DIO0  (via drill 0.3)
  Top 0.127: v35.56,83.95 37.97,81.53 37.97,77.72 41.66,74.04 41.66,69.6 38.23,66.17 38.23,35.69 37.08,34.54 36.32,34.54 35.18,33.4 35.18,20.07 36.7,18.54 36.7,18.16 ESP32.4 | v17.91,87.12 17.14,87.88 LORAMODULE.14
  Bottom 0.127: v35.56,83.95 21.08,83.95 v17.91,87.12
EN  (via drill 0.3)
  Top 0.127: v26.16,49.4 26.16,43.05 27.69,41.53 27.69,41.27 R2.1 | v23.11,46.35 23.5,45.97 23.5,42.42 22.73,41.66 22.73,41.27 C1.1 | v11.3,50.16 11.3,64.64 16.26,69.6 16.26,77.09 26.8,87.63 26.8,90.55 S2.4
  Bottom 0.127: S2.4 26.92,90.68 39.24,90.68 S2.3 | v26.16,49.4 24.13,49.4 22.1,47.37 | 22.1,47.37 20.83,46.1 12.06,46.1 ESP32.16 11.94,46.1 11.3,46.74 v11.3,50.16 | 22.1,47.37 v23.11,46.35
GND
  Top 0.127: LORAMODULE.1 33.02,83.95 32.77,83.95 27.69,78.87 GPSNEO6M.4 | PLUVIOMETERSENSOR.1 42.93,87.88 47.75,87.88 WIND_SENSOR.1 47.88,87.76 47.88,84.84 48.9,83.82 48.9,82.55 47.88,81.53 HMC5883.4 47.75,81.53 42.93,81.53 VL53L0X.4 | S2.1 39.24,95.63 36.07,95.63 33.78,97.92 33.15,97.92 LORAMODULE.8 33.02,97.92 29.21,97.92 26.92,95.63 S2.2 26.8,95.63 26.54,95.89 17.14,95.89 LORAMODULE.10 17.02,95.89 16.38,95.89 14.86,94.36 14.86,89.79 9.78,84.71 9.78,83.82 INA229.7 | CSS811.7 41.78,31.75 45.09,35.05 47.24,35.05 47.5,34.8 47.5,28.96 46.48,27.94 46.48,27.56 R9.1 46.48,27.43 46.48,25.02 47.12,24.38 BTN1.1 47.24,24.26 47.24,20.19 48.26,19.18 48.26,16.89 44.45,13.08 36.83,13.08 ESP32.2 36.7,13.08 30.86,18.92 R7.1 28.32,18.92 22.73,24.51 19.56,24.51 18.03,26.04 BATTERYCONN.OUT- | XC6220B331PR-G.2 25.4,31.11 25.4,30.86 XC6220B331PR-G.TAB 25.27,30.73 24.64,30.73 24.26,30.35 23.11,30.35 18.41,35.05 VEML6070.2 18.54,35.18 21.97,38.61 22.73,38.61 C2.1 22.73,39.88 21.97,40.64 21.97,42.29 22.61,42.93 C1.2 22.61,43.05 22.61,48.26 17.65,53.21 | XC6220B331PR-G.6 25.4,31.24 XC6220B331PR-G.2 | C3.1 27.81,34.54 26.16,32.89 25.4,32.89 XC6220B331PR-G.2 | 17.65,53.21 16.13,54.74 16.13,55.63 BH1750.4 | 17.65,53.21 23.62,59.18 23.62,60.33 19.05,64.9 19.05,68.58 POTENTIOMETER.2
  Bottom 0.127: DHT22.4 44.2,49.4 44.2,53.09 48.01,56.9 48.01,68.71 46.61,70.1 MICRO_SD_CONN.1 46.61,70.23 | 46.61,70.23 41.02,70.23 40.64,69.85 40.64,69.34 35.69,64.39 35.69,63.88 SENSORRAIN.2 | POTENTIOMETER.2 19.05,68.71 19.05,70.23 27.56,78.74 GPSNEO6M.4 27.69,78.87 30.48,78.87 33.02,81.41 42.8,81.41 VL53L0X.4 | SSD1306.4 3.05,78.74 4.7,78.74 9.65,83.69 INA229.7 | J2.FEED 25.78,96.65 26.8,95.63 S2.2 | PLUVIOMETERSENSOR.1 42.93,87.88 42.93,88.39 43.94,89.41 43.94,92.08 40.51,95.5 39.37,95.5 S2.1 | 46.61,70.23 46.61,72.77 48.9,75.06 48.9,80.39 47.88,81.41 HMC5883.4 | SJ3.2 47.88,24.51 47.88,25.53 41.78,31.62 CSS811.7 | BMP180.3 41.91,6.99 41.91,7.87 43.05,9.02 43.05,9.91 40.01,12.95 36.83,12.95 ESP32.2 | SPICONN.4 2.92,34.16 1.78,33.02 1.78,31.24 2.92,30.1 2.92,28.7 I2CCONN.1 2.92,28.57 2.92,27.69 1.27,26.04 1.27,16.76 2.92,15.11 UARTCONN.1 3.05,14.99 3.68,14.99 7.24,11.43 8,11.43 12.06,15.49 ESP32.28 12.06,15.62 12.06,16.13 17.91,21.97 17.91,26.04 | R10.1 22.73,64.9 22.73,64.64 17.27,59.18 17.27,56.9 16.13,55.75 BH1750.4 | 17.91,26.04 17.91,31.5 17.27,32.13 17.27,33.91 18.41,35.05 VEML6070.2 | 17.91,26.04 BATTERYCONN.OUT-
  pour Top: 49.99,99.62 50.32,99.29 50.32,-0.01 50.63,-0.33 0.66,-0.33 0.33,0 0.17,99.77
  pour Bottom: 49.85,99.63 50.25,99.23 50.25,0.52 49.52,-0.22 0.55,-0.22 0.22,0.11 0.28,99.63
IN+
  Bottom 0.127: SENSORRAIN.4 35.56,58.67 35.56,58.17 18.8,41.4 14.1,41.4 12.32,39.62 11.56,39.62 10.41,38.48 10.41,27.3 11.94,25.78 ESP32.24
IN++
  Top 0.127: D1.C 18.54,73.79 18.54,70.74 16.51,68.71 POTENTIOMETER.3
IN--
  Top 0.127: D1.A 14.99,73.79 9.78,68.58 INA229.1
INT
  Top 0.127: CSS811.3 41.66,21.46 41.66,20.57 40.51,19.43 40.51,18.54 41.4,17.65 42.16,17.65 42.93,16.89 42.93,16 41.15,14.22 36.32,14.22 30.35,20.19 30.35,58.42 29.08,59.69 BUZZER.-
  Bottom 0.127: R4.1 8.13,58.8 14.99,58.8 21.84,65.66 27.94,65.66 28.96,64.64 28.96,59.82 BUZZER.-
IO34
  Top 0.127: EXTRACONN.5 7.62,16.13 5.84,17.91 5.84,38.86 6.73,39.75 10.67,39.75 11.94,38.48 ESP32.19
IO35
  Bottom 0.127: EXTRACONN.4 7.62,12.7 10.67,15.75 10.67,15.88 11.56,16.76 12.32,16.76 13.21,17.65 13.21,34.67 12.06,35.81 ESP32.20
MISO  (via drill 0.3)
  Top 0.127: v18.03,68.2 14.61,64.77 14.61,51.69 3.05,40.13 3.05,39.37 SPICONN.2 | v26.42,79.88 32.51,85.98 33.02,85.98 LORAMODULE.2 | v38.73,81.92 38.73,77.72 42.16,74.3 42.16,72.9 46.86,68.2 MICRO_SD_CONN.2 46.86,67.56 45.47,66.17 45.47,63.88 39.5,57.91 v39.5,42.04
  Bottom 0.127: v18.03,68.2 18.03,70.1 26.42,78.49 v26.42,79.88 28.45,81.92 v38.73,81.92 | v39.5,42.04 37.08,39.62 36.32,39.62 35.43,38.73 35.43,35.43 36.7,34.16 36.7,33.4 ESP32.10
MOSI  (via drill 0.3)
  Top 0.127: v32.13,88.9 33.02,88.01 LORAMODULE.3 33.15,87.88 v33.91,87.12
  Bottom 0.127: MICRO_SD_CONN.4 46.86,61.85 36.83,51.82 36.83,48.51 | 36.83,48.51 36.83,46.1 ESP32.15 | v32.13,88.9 18.67,88.9 12.32,82.55 9.4,82.55 8.51,81.66 8.51,79.88 3.56,74.93 2.67,74.93 0.89,73.15 0.89,39.75 2.92,37.72 2.92,36.83 SPICONN.3 | 36.83,48.51 44.45,48.51 49.15,53.21 49.15,81.53 48.26,82.42 45.34,82.42 40.64,87.12 v33.91,87.12
N$1
  Bottom 0.127: LED2.C 3.94,58.04 5.59,58.04 6.22,58.67 R4.2
N$2
  Bottom 0.127: LED1.C 3.94,50.04 5.97,50.04 6.22,50.29 R3.2
N$3
  Top 0.127: BATTERYCONN.IN- 17.53,3.17 10.16,10.54 10.16,17.65 9.53,18.29 9.53,22.61 7.37,24.77 7.37,28.57 SOLARPANELCONN.1
N$4
  Top 0.127: SOLARPANELCONN.2 7.37,31.5 7.37,30.35 9.78,27.94 9.78,18.54 11.56,16.76 18.29,16.76 31.88,3.17 BATTERYCONN.IN+
N$5
  Bottom 0.127: LED3.C 3.94,53.98 5.33,53.98 5.71,53.59 7.11,53.59 7.87,54.36 R5.2
N$7
  Bottom 0.127: LED4.C 3.94,46.1 6.35,46.1 R12.2
N$12  (via drill 0.3)
  Top 0.127: v19.56,98.04 17.14,98.04 LORAMODULE.9
  Bottom 0.127: J2.1 21.84,95.38 21.84,97.92 J2.2 21.84,98.04 v19.56,98.04
NWAKE
  Bottom 0.127: SJ3.1 45.85,24.38 42.04,24.38 41.78,24.13 CSS811.4 41.66,24.13 38.86,26.92 36.32,26.92 26.92,36.32 18.16,36.32 17.4,37.08 11.56,37.08 10.67,36.2 10.67,30.35 11.94,29.08 11.94,28.32 ESP32.23
PLUV  (via drill 0.3)
  Top 0.127: v8.89,36.45 11.94,33.4 ESP32.21
  Bottom 0.127: v8.89,36.45 8.89,38.61 7.75,39.75 7.11,39.75 1.4,45.47 1.4,63.37 4.19,66.17 4.19,74.8 9.27,79.88 10.03,79.88 17.78,87.63 38.1,87.63 40.13,89.66 42.8,89.66 PLUVIOMETERSENSOR.2
POWER  (via drill 0.3)
  Top 0.127: 22.73,35.05 C2.2 22.73,37.08 23.88,38.23 23.88,68.33 32.51,76.96 36.96,76.96 37.97,75.95 37.97,74.42 34.8,71.25 S1.1 | 22.73,35.05 22.73,34.67 23.88,33.53 23.88,30.99 XC6220B331PR-G.4 23.88,30.86 v23.24,30.86 | 22.73,35.05 25.65,35.05 26.16,34.54 26.8,34.54 XC6220B331PR-G.1 | v20.19,22.23 20.19,19.18 R6.2
  Bottom 0.127: v20.19,22.23 23.24,25.27 v23.24,30.86
RESET  (via drill 0.3)
  Top 0.127: v9.4,32.51 10.03,31.88 10.03,23.37 11.94,21.46 11.94,20.7 ESP32.26 | v9.4,47.88 9.65,47.88 14.1,52.32 14.1,65.28 21.34,72.52 21.34,81.79 30.86,91.31 30.86,92.33 32.51,93.98 33.02,93.98 LORAMODULE.6
  Bottom 0.127: v9.4,47.88 v9.4,32.51
RST
  Top 0.127: BTN1.2 47.12,18.16 42.55,18.16 41.78,18.92 CSS811.2
SCK  (via drill 0.3)
  Top 0.127: 23.88,80.01 23.88,81.28 32.51,89.92 33.02,89.92 LORAMODULE.4 | 23.88,80.01 23.88,72.77 22.73,71.63 20.83,71.63 14.35,65.15 14.35,52.2 4.06,41.91 3.05,41.91 SPICONN.1 | v41.15,69.72 41.15,73.15 36.83,77.47 27.3,77.47 26.29,78.49 26.29,79.25 25.53,80.01 23.88,80.01 | v38.73,58.17 38.73,33.66 36.83,31.75 36.83,30.86 ESP32.9
  Bottom 0.127: 45.72,65.15 46.61,65.15 MICRO_SD_CONN.3 45.72,65.15 | v41.15,69.72 45.72,65.15 | 45.72,65.15 v38.73,58.17
SCL  (via drill 0.3)
  Top 0.127: INA229.6 9.65,81.15 9.65,80.26 3.05,73.66 SSD1306.2 2.92,73.53 2.92,72.64 1.78,71.5 1.78,64.26 v8.26,57.78 | BH1750.3 16.13,53.09 16.13,52.2 19.68,48.64 19.68,38.86 18.54,37.72 VEML6070.3 | HMC5883.3 47.75,79.5 42.93,79.5 VL53L0X.3 | v40.01,16.51 40.01,27.43 41.66,29.08 CSS811.6
  Bottom 0.127: I2CCONN.2 3.05,26.16 3.05,27.05 4.19,28.19 4.19,42.29 1.14,45.34 1.14,71.75 2.92,73.53 SSD1306.2 | v40.01,16.51 43.31,13.21 43.31,6.73 41.91,5.33 41.91,4.45 BMP180.2 | 33.15,35.43 33.15,35.18 36.32,32 38.86,32 41.66,29.21 CSS811.6 | 33.15,35.43 33.15,38.99 36.7,42.55 ESP32.14 36.7,43.56 35.43,44.83 35.43,50.8 36.83,52.2 36.83,61.72 36.07,62.48 35.31,62.48 34.42,63.37 34.42,64.26 35.18,65.02 35.94,65.02 36.83,65.91 36.83,66.42 44.07,73.66 44.07,75.06 47.75,78.74 47.75,79.38 HMC5883.3 | 33.15,35.43 32.13,35.43 29.97,37.59 18.54,37.59 VEML6070.3 | v8.26,57.78 11.43,57.78 16,53.21 BH1750.3
SDA  (via drill 0.3)
  Top 0.127: VL53L0X.2 42.93,77.47 47.75,77.47 HMC5883.2 | SSD1306.1 3.05,71.12 3.05,71.88 9.78,78.61 INA229.5 | v43.56,22.35 43.56,24.77 41.78,26.54 CSS811.5 | v14.22,50.55 5.33,41.66 5.33,39.88 3.56,38.1 2.67,38.1 1.78,37.21 1.78,25.65 2.92,24.51 2.92,23.62 I2CCONN.3 | VEML6070.4 18.41,40.26 18.41,41.15 17.27,42.29 17.27,49.4 16.13,50.55 BH1750.2 | v32.38,35.94 36.7,35.94 ESP32.11
  Bottom 0.127: 17.27,68.33 17.14,68.45 17.14,71.25 9.78,78.61 INA229.5 | 17.27,68.33 17.91,67.69 24.89,67.69 30.1,72.9 36.45,72.9 40.89,77.34 42.8,77.34 VL53L0X.2 | CSS811.5 41.78,26.67 41.78,27.56 42.93,28.7 42.93,29.59 42.04,30.48 41.27,30.48 36.83,34.92 36.83,35.81 ESP32.11 | v43.56,22.35 43.56,4.45 41.91,2.79 41.91,1.91 BMP180.1 | BH1750.2 16,50.55 v14.22,50.55 7.24,57.53 7.24,59.31 7.49,59.56 8.51,59.56 17.27,68.33 | v32.38,35.94 32,35.94 27.81,40.13 18.54,40.13 VEML6070.4
SENSOR_VN
  Bottom 0.127: EXTRACONN.7 7.62,21.21 10.16,23.75 10.16,39.12 ESP32.18
SENSOR_VP
  Bottom 0.127: EXTRACONN.6 7.62,18.67 6.48,19.81 6.48,26.16 9.91,29.59 9.91,41.4 ESP32.17
SWITCHW
  Top 0.127: BATTERYCONN.OUT+ 31.88,26.04 31.88,70.1 31.5,70.48 31.5,71.88 34.67,75.06 S1.2
U0RXD
  Bottom 0.127: EXTRACONN.3 7.62,10.03 10.67,10.03 11.56,9.14 21.84,9.14 32.13,19.43 36.2,19.43 36.32,19.3 37.85,19.3 41.4,22.86 47.88,22.86 48.64,23.62 48.64,26.42 42.04,33.02 41.27,33.02 36.83,37.47 36.83,38.35 ESP32.12
U0TXD  (via drill 0.3)
  Top 0.127: v32.26,18.92 32.26,23.5 33.66,24.89 v33.66,35.43
  Bottom 0.127: v32.26,18.92 20.95,7.62 7.62,7.62 EXTRACONN.2 | v33.66,35.43 33.66,37.85 ESP32.13
U2RX  (via drill 0.3)
  Top 0.127: v9.65,11.43 7.24,11.43 6.22,12.45 3.05,12.45 UARTCONN.2 | v22.61,72.14 22.61,78.74 GPSNEO6M.2 | v25.65,69.09 25.65,36.83 v27.3,35.18
  Bottom 0.127: v9.65,11.43 11.3,11.43 11.56,11.68 24,11.68 34.16,21.84 37.08,21.84 37.97,22.73 37.97,24.51 36.83,25.65 ESP32.7 36.7,25.78 v27.3,35.18 | v25.65,69.09 v22.61,72.14
U2TX  (via drill 0.3)
  Top 0.127: v8.76,10.92 8.76,9.65 8,8.89 7.24,8.89 6.22,9.91 3.05,9.91 UARTCONN.3 | v25.15,70.48 25.15,78.74 GPSNEO6M.3 | v26.04,69.6 26.04,69.34 31.37,64.01 v31.37,29.46
  Bottom 0.127: v8.76,10.92 8.76,11.43 11.56,14.22 26.16,14.22 35.05,23.11 | 35.05,23.11 ESP32.6 | v26.04,69.6 v25.15,70.48 | v31.37,29.46 35.05,25.78 35.05,23.11
VBS
  Top 0.127: INA229.3 9.78,73.53 9.78,71.12 INA229.2
  Bottom 0.127: LED4.A 2.16,46.1 2.16,48.77 2.92,49.53 2.92,64.26 9.65,70.99 INA229.2
VIN  (via drill 0.3)
  Top 0.127: EXTRACONN.8 7.62,21.97 9.27,20.32 9.27,17.91 v9.65,17.53 | v10.67,16.51 10.67,11.81 11.94,10.54 ESP32.30
  Bottom 0.127: v10.67,16.51 v9.65,17.53
XSHUT
  Top 0.127: VL53L0X.1 42.93,75.44 43.31,75.44 48.51,70.23 48.51,16.76 42.42,10.67 41.4,10.67 33.53,2.79 33.53,1.91 33.27,1.65 10.92,1.65 7.62,4.95 EXTRACONN.1

### Text on the board
tPlace: ANT | GND | GND | RESET | CS_LORA | 3v3 | 3V3 | ALBERTO / GOMEZ / V1 | 3V3 | SCK | PLUV | ANE | DIO0 | MOSI | GND | GND | MISO | 3V3 | GND | GND | 3V3 | 3V3 | GND | GND | SCL | 3V3 | TX2 | RX2 | GND | SCL | SCL | SDA | SDA | SDA | ALE | SUT | DDY | VBS | IN+ | SOLAR ADJUST | GND | IN- | 3V3 | MIS | GND | CLK | D01 | MOS | - | IN+ | CS | + | + | - | 3V3 | GND | DAT | + | 3V3 | SCK | MIS | MOS | - | + | GND | 3V3 | GND | 3V3 | GND | SCL | - | SDA | SCL | WAK | SDA | VIN | INT | 3V3 | VN | RST | BAT | VP | GND | IO34 | RX2 | IO35 | TX2 | RX0 | 3V3 | TX0 | 3V3 | GND | SCL | XSHUT | SDA
bPlace: GND | EN | GND | WHETHER / STATION | 3V3 | SCL | SDA | ON | 3V3 | GAS | GND | UV | SCL | SDA | RAIN | ADD | PWR | ACK | SDA | SCL | GND | 3V3 | + | -